# EAGLE design rapidshark-lipo-sensor-mk-2.3 (EAGLE 7.5.0)
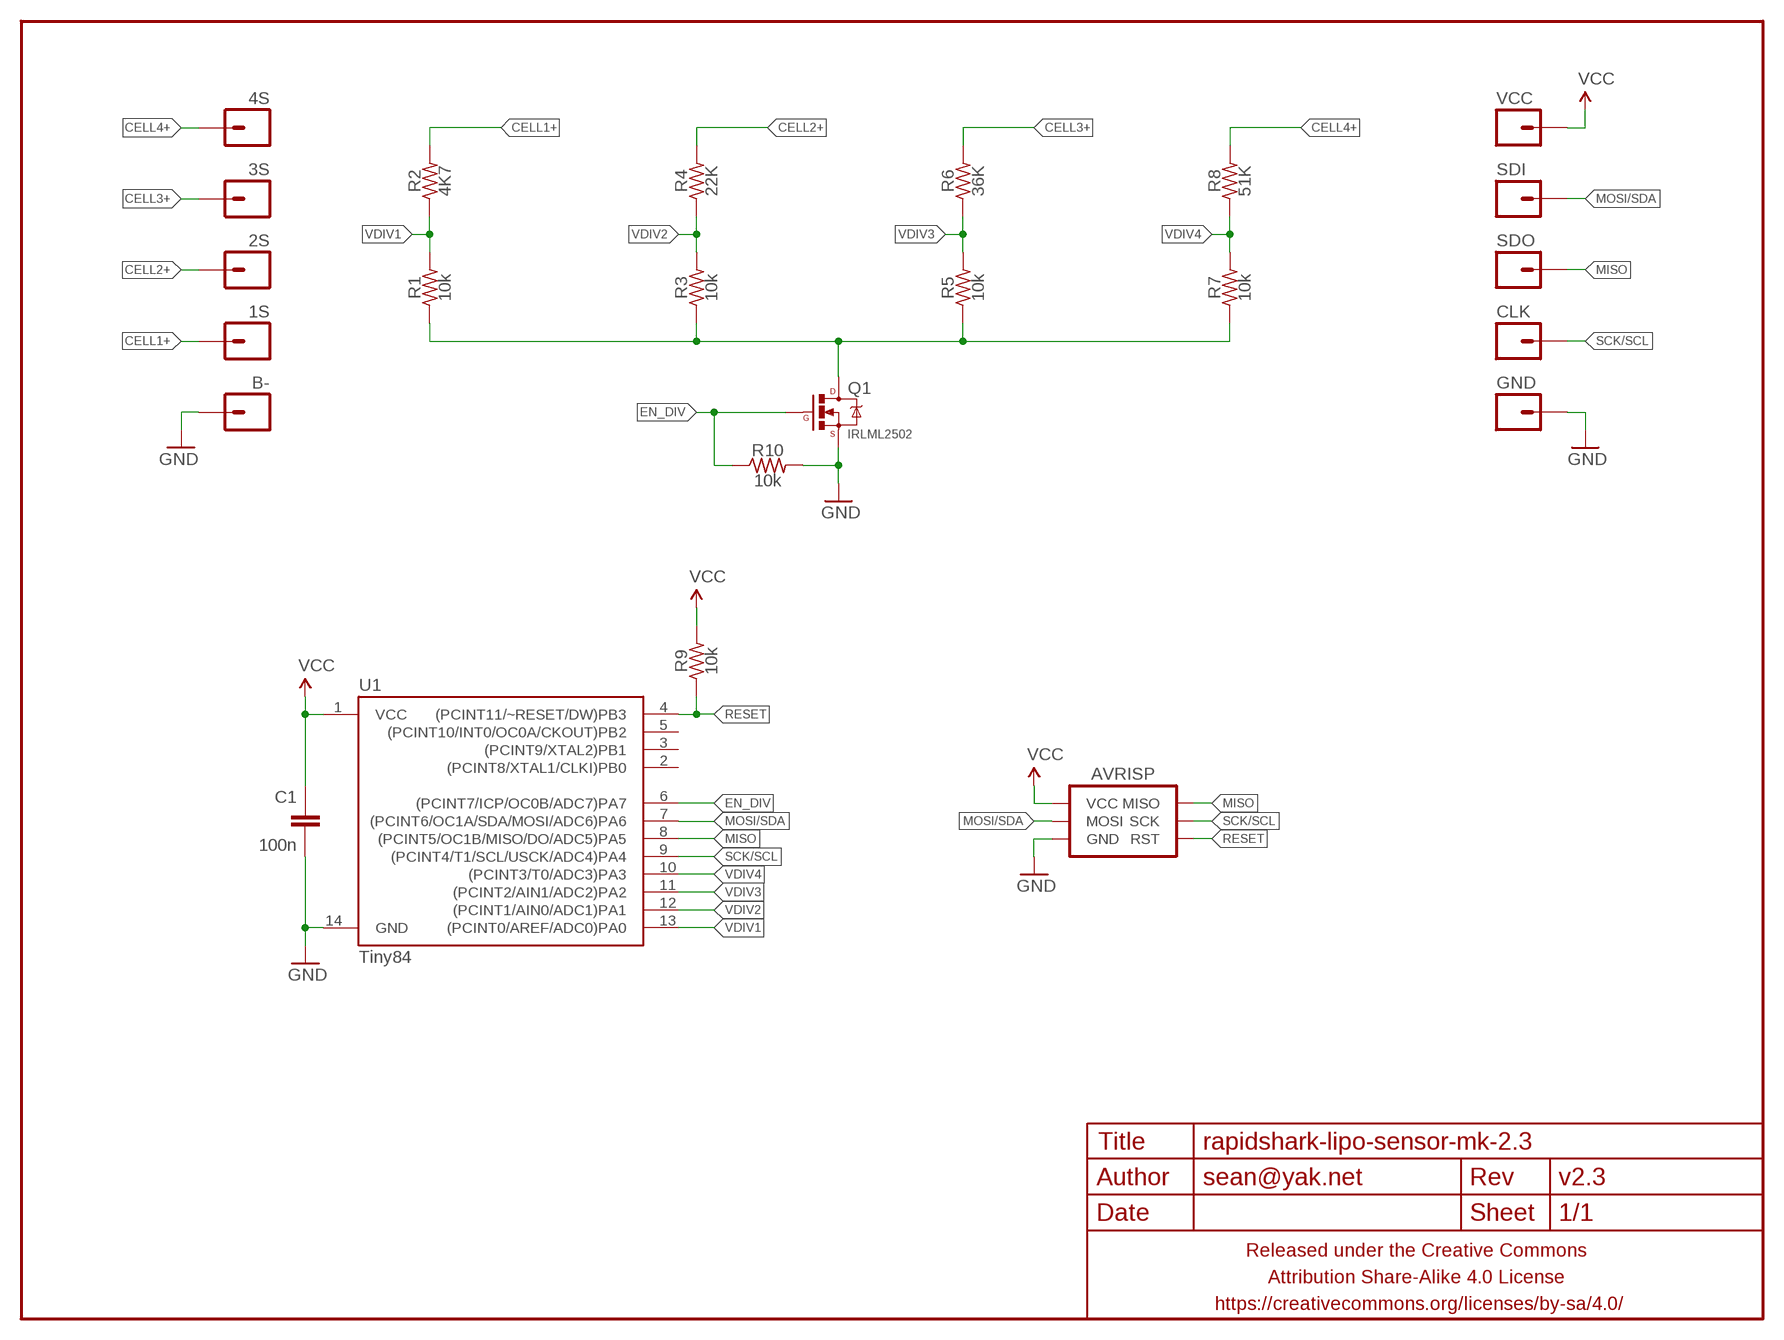
[diagram p0: schematic, sheet 1]

## Parts
1S  M01PTH-0.9MM  [1X01-0.9MM]
2S  M01PTH-0.9MM  [1X01-0.9MM]
3S  M01PTH-0.9MM  [1X01-0.9MM]
4S  M01PTH-0.9MM  [1X01-0.9MM]
AVRISP  AVR_SPI_PRG_6TESTPOINTS  [2X3_TEST_POINTS]
B-  M01PTH-0.9MM  [1X01-0.9MM]
C1  100n  CAPACITOR-CERAMICC0603-TIGHTER  [C0603-TIGHTER]
CLK  M01PTH-0.9MM  [1X01-0.9MM]
FRAME1  FRAME-LETTERNO_PACKAGE  [DUMMY]
GND  M01PTH-0.9MM  [1X01-0.9MM]
Q1  IRLML2502  MOSFET-NCHANNELIRLML2502  [SOT23]
R1  10k  RESISTORR0603-TIGHTER  [R0603-TIGHTER]
R2  4K7  RESISTORR0603-TIGHTER  [R0603-TIGHTER]
R3  10k  RESISTORR0603-TIGHTER  [R0603-TIGHTER]
R4  22K  RESISTORR0603-TIGHTER  [R0603-TIGHTER]
R5  10k  RESISTORR0603-TIGHTER  [R0603-TIGHTER]
R6  36K  RESISTORR0603-TIGHTER  [R0603-TIGHTER]
R7  10k  RESISTORR0603-TIGHTER  [R0603-TIGHTER]
R8  51K  RESISTORR0603-TIGHTER  [R0603-TIGHTER]
R9  10k  RESISTORR0603-TIGHTER  [R0603-TIGHTER]
R10  10k  RESISTORR0603-TIGHTER  [R0603-TIGHTER]
SDI  M01PTH-0.9MM  [1X01-0.9MM]
SDO  M01PTH-0.9MM  [1X01-0.9MM]
U1  Tiny84  ATTINY84  [SO14]
VCC  M01PTH-0.9MM  [1X01-0.9MM]

## Nets
CELL1+: 1S.1 R2.2
CELL2+: 2S.1 R4.2
CELL3+: 3S.1 R6.2
CELL4+: 4S.1 R8.2
EN_DIV: Q1.1(G) R10.1 U1.6((PCINT7/ICP/OC0B/ADC7)PA7)
GND: AVRISP.6(GND) B-.1 C1.2 GND.1 Q1.2(S) R10.2 U1.14(GND)
MISO: AVRISP.1(MISO) SDO.1 U1.8((PCINT5/OC1B/MISO/DO/ADC5)PA5)
MOSI/SDA: AVRISP.4(MOSI) SDI.1 U1.7((PCINT6/OC1A/SDA/MOSI/ADC6)PA6)
N$1: Q1.3(D) R1.1 R3.1 R5.1 R7.1
RESET: AVRISP.5(RST) R9.1 U1.4((PCINT11/~RESET/DW)PB3)
SCK/SCL: AVRISP.3(SCK) CLK.1 U1.9((PCINT4/T1/SCL/USCK/ADC4)PA4)
VCC: AVRISP.2(VCC) C1.1 R9.2 U1.1(VCC) VCC.1
VDIV1: R1.2 R2.1 U1.13((PCINT0/AREF/ADC0)PA0)
VDIV2: R3.2 R4.1 U1.12((PCINT1/AIN0/ADC1)PA1)
VDIV3: R5.2 R6.1 U1.11((PCINT2/AIN1/ADC2)PA2)
VDIV4: R7.2 R8.1 U1.10((PCINT3/T0/ADC3)PA3)
Unconnected: U1.2((PCINT8/XTAL1/CLKI)PB0) U1.3((PCINT9/XTAL2)PB1) U1.5((PCINT10/INT0/OC0A/CKOUT)PB2)

## Library data of the parts
1S 2S 3S 4S B- CLK GND SDI SDO VCC = a_parts:M01: Header 1 Standard 1-pin 0.1" header. Use with straight break away headers (SKU : PRT-00116), right angle break away headers (PRT-00553), swiss pins (PRT-00743), machine pins (PRT-00117), and female headers (PRT-00115).
AVRISP = A_butts:AVR_SPI_PRG_6: AVR ISP 6 Pin This is the reduced ISP connector for AVR programming. Common on Arduino. This footprint will take up less PCB space and can be used with a 10-pin to 6-pin adapter such as SKU: BOB-08508 **Special note about "TEST_POINT" package. The stop mask is on the top side, so if you want your programming test points to be on the bottom of your board, make sure to place this package on the bottom side of the board. This also ensure that the orientation to program from the bottom side will be correct.
C1 = a_parts:CAPACITOR-CERAMIC: CAPACITOR, European symbol
FRAME1 = A_butts:FRAME-LETTER: Schematic Frame Standard 8.5x11 US Letter frame; DESIGNER: sean@yak.net; VERSION: v2.3
Q1 = a_parts:MOSFET-NCHANNEL: Common NMOSFET Parts MFG P/N Store ID Prod ID FDD8780 TRANS-09984 SI7820DN TRANS-11055 FDS6630A IC-08089 2N7002PW TRANS-11151 FQP30N06L COM-10213 TRANS-10060 BSS123LT1G TRANS-08345 BSS138 TRANS-00830 BS170 2N7000
R1-R10 = a_parts:RESISTOR: RESISTOR, American symbol
U1 = A_butts:ATTINY84: Atmel 14-pin 2/4/8kB flash uC

## Board
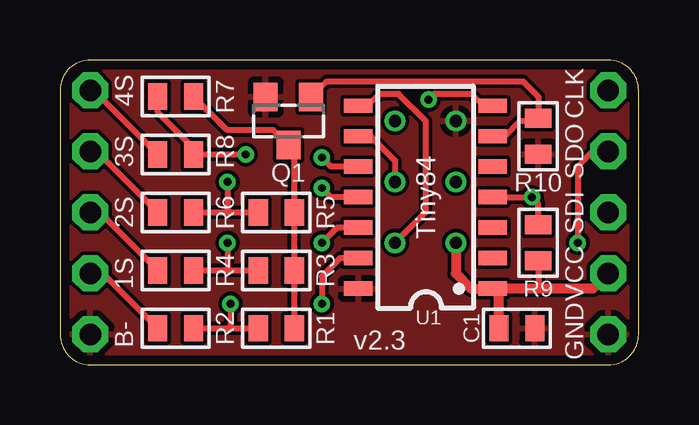
[diagram p1: board, top side]
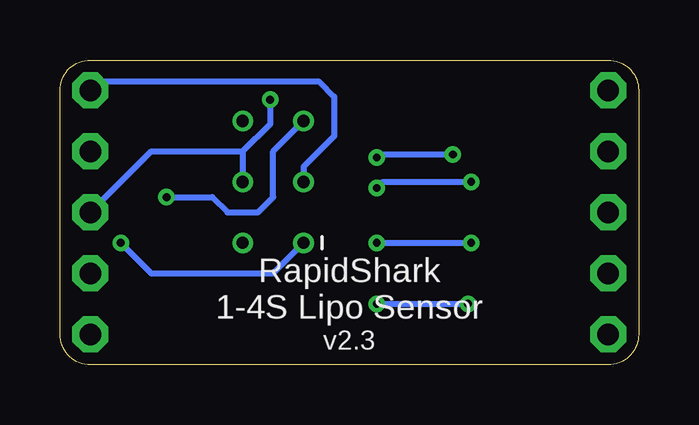
[diagram p2: board, bottom side, seen from below]

Size 24.13 x 12.7 mm. Coordinates in mm from the lower left corner, seen from the top.
Outline: 24.13,1.27 24.13,11.43 arc90 22.86,12.7 1.27,12.7 arc90 0,11.43 0,1.27 arc90 1.27,0 22.86,0 arc90 24.13,1.27
Copper layers (1*16): Top 0.0356mm / dielectric 1.5011mm / Bottom 0.0356mm
Design rules "LaenPCBOrder_2": minimum track width 6mil, minimum drill 13mil, track to track 6mil, track to pad 6mil, pad to pad 6mil, via to via 6mil, smd to smd 6mil, copper to edge 15mil, drill to drill 6mil, minimum pad ring 7mil, minimum via ring 7mil, stop-mask expansion 3mil, vias tented up to drill 20mil, thermal gap 10mil

### Footprints (pad centres in the part's own frame; a part is rotated, then mirrored left to right if it is on the bottom)
1X01-0.9MM = drill 0.9 pad 1.5 octagon: 1 0,0
2X3_TEST_POINTS = drill 0.508: 1 -2.54,-1.27; 2 -2.54,1.27; 3 0,-1.27; 4 0,1.27; 5 2.54,-1.27; 6 2.54,1.27
C0603-TIGHTER = smd 0.8 x 1.1: 1 -0.75,0; 2 0.75,0
SOT23 = smd 1 x 1.2: 1 -0.95,-1; 2 0.95,-1; 3 0,1
R0603-TIGHTER = smd 0.8 x 1.1: 1 -0.75,0; 2 0.75,0
SO14 = smd 0.6 x 1.2: 1 -3.81,-2.8; 2 -2.54,-2.8; 3 -1.27,-2.8; 4 0,-2.8; 5 1.27,-2.8; 6 2.54,-2.8; 7 3.81,-2.8; 8 3.81,2.8; 9 2.54,2.8; 10 1.27,2.8; 11 0,2.8; 12 -1.27,2.8; 13 -2.54,2.8; 14 -3.81,2.8

### Placement (x,y rotation side)
1S  1.27,3.81 270 top
2S  1.27,6.35 270 top
3S  1.27,8.89 270 top
4S  1.27,11.43 270 top
AVRISP  15.24,7.62 90 bottom
B-  1.27,1.27 270 top
C1  19.05,1.52 0 top
CLK  22.86,11.43 90 top
FRAME1  0,0 0 top
GND  22.86,1.27 90 top
Q1  9.53,10.16 180 top
R1  9.02,1.52 180 top
R2  4.83,1.52 180 top
R3  9.02,3.94 180 top
R4  4.83,3.94 180 top
R5  9.02,6.35 180 top
R6  4.83,6.35 180 top
R7  4.83,11.18 180 top
R8  4.83,8.76 180 top
R9  19.94,5.08 270 top
R10  19.94,9.53 270 top
SDI  22.86,6.35 90 top
SDO  22.86,8.89 90 top
U1  15.24,6.99 90 top
VCC  22.86,3.81 90 top

### Tracks (layer width: path | path; a pad name or v marks a point on that pad's centre or on a via)
CELL1+
  Top 0.254: 1S.1 1.79,3.81 R2.2
CELL2+
  Top 0.254: 2S.1 1.66,6.35 R4.2
CELL3+
  Top 0.254: 3S.1 1.54,8.89 R6.2
CELL4+
  Top 0.254: 4S.1 1.41,11.43 R8.2
EN_DIV
  Top 0.254: U1.6 18.54,9.53 19.18,10.16 19.82,10.16 R10.1 19.94,11.18 19.3,11.81 11.13,11.81 Q1.1
GND
  pour Top: 0,1.27 0,11.43 arc-90 1.27,12.7 22.86,12.7 arc-90 24.13,11.43 24.13,1.27 arc-90 22.86,0 1.27,0 arc-90
MISO  (via drill 0.33)
  Top 0.254: U1.8 12.83,10.79 13.34,11.3 14.1,11.3 15.24,10.16 15.24,6.35 AVRISP.1 | SDO.1 22.23,8.89 21.59,8.26 v21.59,5.08
  Bottom 0.254: v21.59,5.08 20.32,3.81 15.24,3.81 AVRISP.1
MOSI/SDA  (via drill 0.33)
  Top 0.254: U1.7 17.65,10.79 17.14,11.3 15.62,11.3 v15.37,11.05
  Bottom 0.254: SDI.1 20.32,8.89 16.51,8.89 | v15.37,11.05 15.37,10.03 16.51,8.89 | 16.51,8.89 AVRISP.4
N$1
  Top 0.254: R7.1 6.97,9.78 8.91,9.78 Q1.3 9.77,8.92 R5.1 R3.1 R1.1
RESET  (via drill 0.33)
  Top 0.254: U1.4 v19.68,6.99 19.94,6.73 R9.1
  Bottom 0.254: v19.68,6.99 17.78,6.99 17.14,6.35 15.88,6.35 15.24,6.99 15.24,8.89 AVRISP.5
SCK/SCL
  Top 0.254: U1.9 12.95,9.53 13.97,8.51 AVRISP.3
  Bottom 0.254: CLK.1 22.48,11.81 13.34,11.81 12.7,11.18 12.7,9.53 13.97,8.26 AVRISP.3
VCC
  Top 0.254: R9.2 19.94,3.3 20.07,3.17
  Top 0.406: VCC.1 22.23,3.17 20.07,3.17 U1.1 | AVRISP.2 16.51,3.81 17.14,3.17 U1.1 | C1.1 18.3,2.92 U1.1
VDIV1  (via drill 0.33)
  Top 0.254: R2.1 7.11,1.52 | 7.11,1.52 R1.2 | v7.11,2.54 7.11,1.52 | U1.13 11.68,4.45 10.92,3.68 v10.92,2.54
  Bottom 0.254: v10.92,2.54 v7.11,2.54
VDIV2  (via drill 0.33)
  Top 0.254: R4.1 6.99,3.94 | 6.99,3.94 R3.2 | v6.99,5.08 6.99,3.94 | U1.12 11.56,5.71 v10.92,5.08
  Bottom 0.254: v10.92,5.08 v6.99,5.08
VDIV3  (via drill 0.33)
  Top 0.254: R6.1 6.99,6.35 | 6.99,6.35 R5.2 | v6.99,7.62 6.99,6.35 | U1.11 11.3,6.99 v10.92,7.37
  Bottom 0.254: v10.92,7.37 10.67,7.62 v6.99,7.62
VDIV4  (via drill 0.33)
  Top 0.254: R7.2 4.08,10.53 5.58,9.03 R8.1 v7.75,8.76 | U1.10 11.3,8.26 v10.92,8.64
  Bottom 0.254: v10.92,8.64 10.79,8.76 v7.75,8.76

### Text on the board
bPlace: RapidShark / 1-4S Lipo Sensor